# Altium project Logic-Analyzer-01.PrjPcb
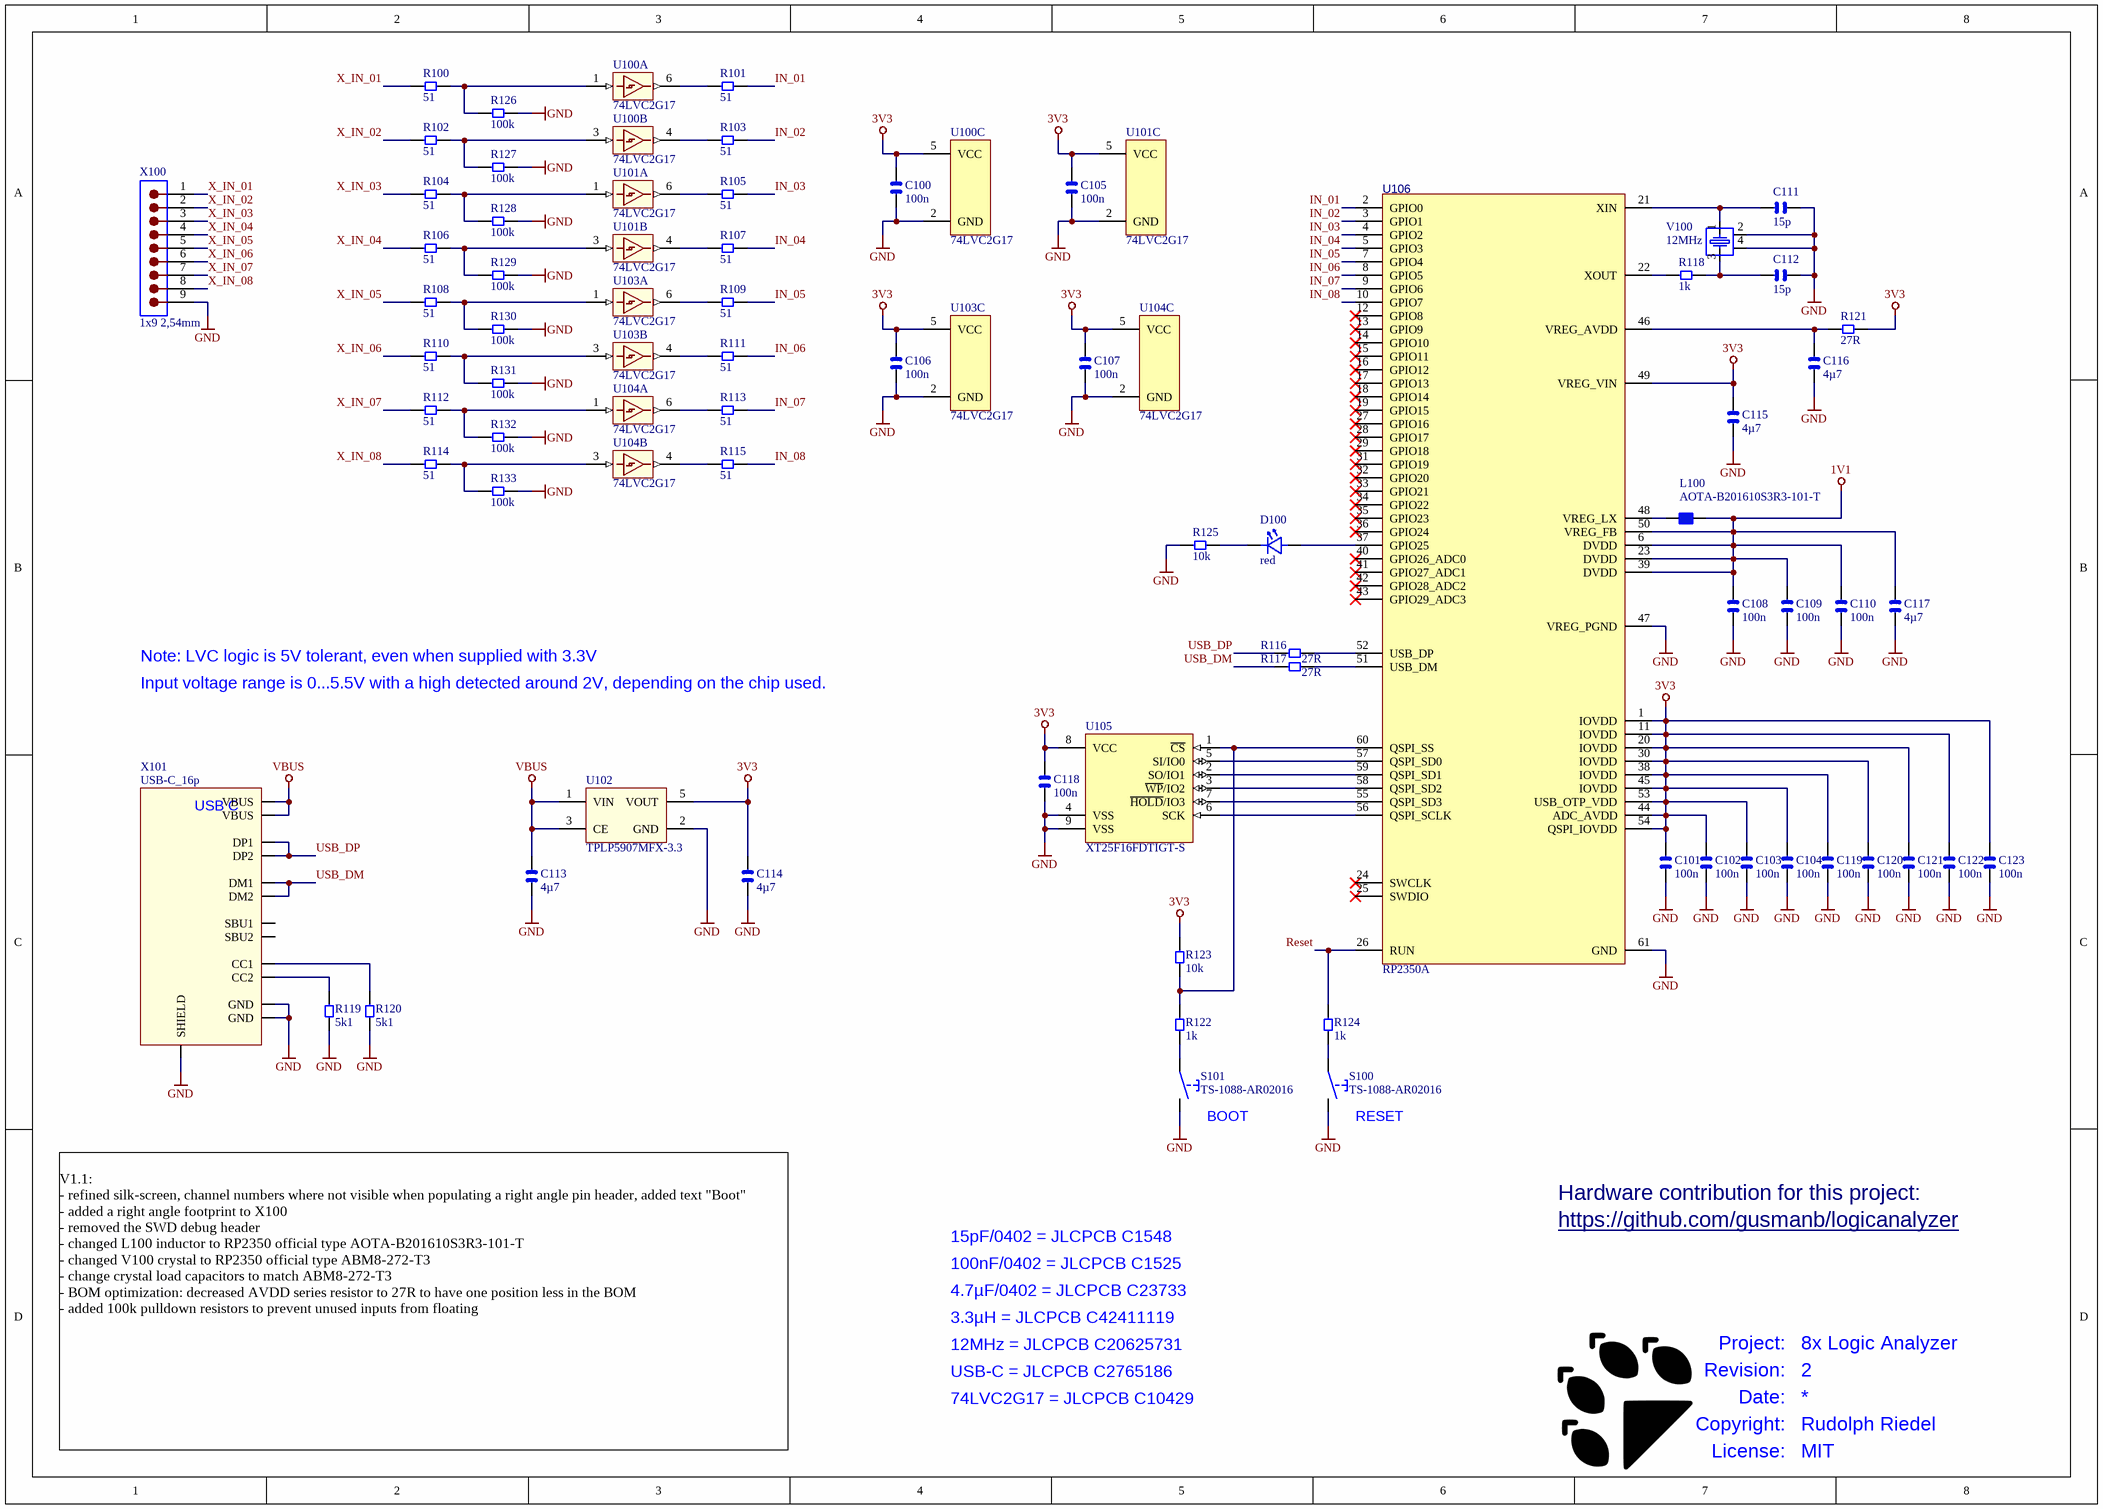
[diagram p0: Logic-Analyzer-01.SchDoc]
1 sheet, 72 parts. Net scope: global (net labels, ports and power ports of the same name join across sheets).
Board file: Logic-Analyzer-01.PcbDoc

## Sheet Logic-Analyzer-01.SchDoc: 8x Logic Analyzer
size A3; Organization: Organization; Address1: Address1; Address2: Address2; Address3: Address3; Address4: Address4; DocumentNumber: 1; Revision: 2; SheetNumber: 1; SheetTotal: 1; PageSetup: Record=PageOptions|CenterHorizontal=True|CenterVertical=True|PrintScale=1.00|XCorrection=1.00|YCorrection=1.00|PrintKind=1|BorderSize=5000000|LeftOffset=0|BottomOffset=0|Orientation=2|PaperLength=1000|PaperWidth=1000|Scale=100|PaperSource=7|PrintQuality=-4|MediaType=1|DitherType=10|PaperKind=A3|PrintScaleMode=0

### Parts
C100  100n  [CAPC1005X06N]
C101  100n  [CAPC1005X06N]
C102  100n  [CAPC1005X06N]
C103  100n  [CAPC1005X06N]
C104  100n  [CAPC1005X06N]
C105  100n  [CAPC1005X06N]
C106  100n  [CAPC1005X06N]
C107  100n  [CAPC1005X06N]
C108  100n  [CAPC1005X06N]
C109  100n  [CAPC1005X06N]
C110  100n  [CAPC1005X06N]
C111  15p  [CAPC1005X06N]
C112  15p  [CAPC1005X06N]
C113  4µ7  [CAPC1005X06N]
C114  4µ7  [CAPC1005X06N]
C115  4µ7  [CAPC1005X06N]
C116  4µ7  [CAPC1005X06N]
C117  4µ7  [CAPC1005X06N]
C118  100n  [CAPC1005X06N]
C119  100n  [CAPC1005X06N]
C120  100n  [CAPC1005X06N]
C121  100n  [CAPC1005X06N]
C122  100n  [CAPC1005X06N]
C123  100n  [CAPC1005X06N]
D100  red  [DIOC1608X06N_LED]
L100  AOTA-B201610S3R3-101-T  [PowerInductor_2.0x1.6]
R100  51  [RESC1608X06L]
R101  51  [RESC1608X06L]
R102  51  [RESC1608X06L]
R103  51  [RESC1608X06L]
R104  51  [RESC1608X06L]
R105  51  [RESC1608X06L]
R106  51  [RESC1608X06L]
R107  51  [RESC1608X06L]
R108  51  [RESC1608X06L]
R109  51  [RESC1608X06L]
R110  51  [RESC1608X06L]
R111  51  [RESC1608X06L]
R112  51  [RESC1608X06L]
R113  51  [RESC1608X06L]
R114  51  [RESC1608X06L]
R115  51  [RESC1608X06L]
R116  27R  [RESC1608X06L]
R117  27R  [RESC1608X06L]
R118  1k  [RESC1608X06L]
R119  5k1  [RESC1608X06L]
R120  5k1  [RESC1608X06L]
R121  27R  [RESC1608X06L]
R122  1k  [RESC1608X06L]
R123  10k  [RESC1608X06L]
R124  1k  [RESC1608X06L]
R125  10k  [RESC1608X06L]
R126  100k  [RESC1005X06N]
R127  100k  [RESC1005X06N]
R128  100k  [RESC1005X06N]
R129  100k  [RESC1005X06N]
R130  100k  [RESC1005X06N]
R131  100k  [RESC1005X06N]
R132  100k  [RESC1005X06N]
R133  100k  [RESC1005X06N]
S100  TS-1088-AR02016  [TS-1088-AR02016]
S101  TS-1088-AR02016  [TS-1088-AR02016]
U100  74LVC2G17  [SOT95P280X110-6N]  (parts A,B,C of 3)
U101  74LVC2G17  [SOT95P280X110-6N]  (parts A,B,C of 3)
U102  TPLP5907MFX-3.3  [SOT95P280X110-5N]
U103  74LVC2G17  [SOT95P280X110-6N]  (parts A,B,C of 3)
U104  74LVC2G17  [SOT95P280X110-6N]  (parts A,B,C of 3)
U105  XT25F16FDTIGT-S  [USONP50X200X300X8N]
U106  RP2350A  [QFN40P700X700X085-60EP]
V100  12MHz  [ABM8]
X100  1x9 2,54mm  [PINH_1x09_2_54mm_RA]
X101  USB-C_16p  [USBC_16P]

### Nets
1V1: C108.2 C109.2 C110.2 C117.2 L100.1 U106.6(DVDD) U106.23(DVDD) U106.39(DVDD) U106.50(VREG_FB)
3V3: C100.2 C101.2 C102.2 C103.2 C104.2 C105.2 C106.2 C107.2 C114.2 C115.2 C118.2 C119.2 C120.2 C121.2 C122.2 C123.2 R121.2 R123.2 U100.5(VCC) U101.5(VCC) U102.5(VOUT) U103.5(VCC) U104.5(VCC) U105.8(VCC) U106.1(IOVDD) U106.11(IOVDD) U106.20(IOVDD) U106.30(IOVDD) U106.38(IOVDD) U106.44(ADC_AVDD) U106.45(IOVDD) U106.49(VREG_VIN) U106.53(USB_OTP_VDD) U106.54(QSPI_IOVDD)
GND: C100.1 C101.1 C102.1 C103.1 C104.1 C105.1 C106.1 C107.1 C108.1 C109.1 C110.1 C111.1 C112.1 C113.1 C114.1 C115.1 C116.1 C117.1 C118.1 C119.1 C120.1 C121.1 C122.1 C123.1 R119.1 R120.1 R125.2 R126.2 R127.2 R128.2 R129.2 R130.2 R131.2 R132.2 R133.2 S100.2 S101.2 U100.2(GND) U101.2(GND) U102.2(GND) U103.2(GND) U104.2(GND) U105.4(VSS) U105.9(VSS) U106.47(VREG_PGND) U106.61(GND) V100.2 V100.4 X100.9 X101.A1-B12(GND) X101.B1-A12(GND) X101.SHIELD
VBUS: C113.2 U102.1(VIN) U102.3(CE) X101.A4-B9(VBUS) X101.B4-A9(VBUS)
IN_01: R101.2 U106.2(GPIO0)
IN_02: R103.2 U106.3(GPIO1)
IN_03: R105.2 U106.4(GPIO2)
IN_04: R107.2 U106.5(GPIO3)
IN_05: R109.2 U106.7(GPIO4)
IN_06: R111.2 U106.8(GPIO5)
IN_07: R113.2 U106.9(GPIO6)
IN_08: R115.2 U106.10(GPIO7)
Reset: R124.2 U106.26(RUN)
USB_DM: R117.1 X101.A7(DM1) X101.B7(DM2)
USB_DP: R116.1 X101.A6(DP1) X101.B6(DP2)
X_IN_01: R100.1 X100.1
X_IN_02: R102.1 X100.2
X_IN_03: R104.1 X100.3
X_IN_04: R106.1 X100.4
X_IN_05: R108.1 X100.5
X_IN_06: R110.1 X100.6
X_IN_07: R112.1 X100.7
X_IN_08: R114.1 X100.8
NetC111_2: C111.2 U106.21(XIN) V100.1
NetC112_2: C112.2 R118.2 V100.3
NetC116_2: C116.2 R121.1 U106.46(VREG_AVDD)
NetD100_1: D100.1 R125.1
NetD100_2: D100.2 U106.37(GPIO25)
NetL100_2: L100.2 U106.48(VREG_LX)
NetR100_2: R100.2 R126.1 U100.1(1A)
NetR101_1: R101.1 U100.6(1Y)
NetR102_2: R102.2 R127.1 U100.3(2A)
NetR103_1: R103.1 U100.4(2Y)
NetR104_2: R104.2 R128.1 U101.1(1A)
NetR105_1: R105.1 U101.6(1Y)
NetR106_2: R106.2 R129.1 U101.3(2A)
NetR107_1: R107.1 U101.4(2Y)
NetR108_2: R108.2 R130.1 U103.1(1A)
NetR109_1: R109.1 U103.6(1Y)
NetR110_2: R110.2 R131.1 U103.3(2A)
NetR111_1: R111.1 U103.4(2Y)
NetR112_2: R112.2 R132.1 U104.1(1A)
NetR113_1: R113.1 U104.6(1Y)
NetR114_2: R114.2 R133.1 U104.3(2A)
NetR115_1: R115.1 U104.4(2Y)
NetR116_2: R116.2 U106.52(USB_DP)
NetR117_2: R117.2 U106.51(USB_DM)
NetR118_1: R118.1 U106.22(XOUT)
NetR119_2: R119.2 X101.B5(CC2)
NetR120_2: R120.2 X101.A5(CC1)
NetR122_1: R122.1 S101.1
NetR122_2: R122.2 R123.1 U105.1(~{CS}) U106.60(QSPI_SS)
NetR124_1: R124.1 S100.1
NetU105_2: U105.2(SO/IO1) U106.59(QSPI_SD1)
NetU105_3: U105.3(~{WP}/IO2) U106.58(QSPI_SD2)
NetU105_5: U105.5(SI/IO0) U106.57(QSPI_SD0)
NetU105_6: U105.6(SCK) U106.56(QSPI_SCLK)
NetU105_7: U105.7(~{HOLD}/IO3) U106.55(QSPI_SD3)

Not connected (* = marked no-connect by the designer): U106 12(GPIO8)* 13(GPIO9)* 14(GPIO10)* 15(GPIO11)* 16(GPIO12)* 17(GPIO13)* 18(GPIO14)* 19(GPIO15)* 24(SWCLK)* 25(SWDIO)* 27(GPIO16)* 28(GPIO17)* 29(GPIO18)* 31(GPIO19)* 32(GPIO20)* 33(GPIO21)* 34(GPIO22)* 35(GPIO23)* 36(GPIO24)* 40(GPIO26_ADC0)* 41(GPIO27_ADC1)* 42(GPIO28_ADC2)* 43(GPIO29_ADC3)*; X101 A8(SBU1) B8(SBU2)

### Notes on the sheet
- Note: LVC logic is 5V tolerant, even when supplied with 3.3V
- Input voltage range is 0...5.5V with a high detected around 2V, depending on the chip used.
- (near S101) BOOT
- (near S100) RESET
- 15pF/0402 = JLCPCB C1548
- https://github.com/gusmanb/logicanalyzer
- Hardware contribution for this project:
- 4.7µF/0402 = JLCPCB C23733
- 100nF/0402 = JLCPCB C1525
- 3.3µH = JLCPCB C42411119
- 12MHz = JLCPCB C20625731
- USB-C = JLCPCB C2765186
- V1.1:
  - refined silk-screen, channel numbers where not visible when populating a right angle pin header, added text "Boot"
  - added a right angle footprint to X100
  - removed the SWD debug header
  - changed L100 inductor to RP2350 official type AOTA-B201610S3R3-101-T
  - changed V100 crystal to RP2350 official type ABM8-272-T3
  - change crystal load capacitors to match ABM8-272-T3
  - BOM optimization: decreased AVDD series resistor to 27R to have one position less in the BOM
  - added 100k pulldown resistors to prevent unused inputs from floating
- 74LVC2G17 = JLCPCB C10429
- Project:
- Revision:
- Date:
- Copyright:
- License:
- Rudolph Riedel
- MIT
- (in symbol USB-C_16p) USB C

### Library data of the parts
C100-C123 = CAPC_0402: 0402 Chip Capacitor; Editor: rriedel; Categorie: generic; Type: unpolarized; Part Number: CAPC_0402; Status: tested; Date: 19.07.2025; PackageDescription: 0402; Group: Capacitor
  C100-C110 C118-C123: Value: 100n
  C111 C112: Value: 15p
  C113-C117: Value: 4µ7
D100 = LED_0603: LED, 0603; Editor: rriedel; Categorie: generic; Group: Diode; Part Number: LED_0603; Value: red; Status: tested; Date: 29.06.2020; PackageDescription: 0603; Type: generic
L100 = AOTA-B201610S3R3-101-T: 3.3µH, 2.8A, 2.0mm x 1.6mm x 1.0mm; Manufacturer: Abracom; Editor: rriedel; Categorie: Part; Group: Inductor; Type: Power; Part Number: AOTA-B201610S3R3-101-T; Value: AOTA-B201610S3R3-101-T; Status: new; Date: 17.08.2025; PackageDescription: 2.0mm x 1.6mm; Part_Number_1: AOTA-B201610S3R3-101-T; Distributor_1: JLCBCP; Distributor_1_Part_Number: C42411119
R100-R125 = RESC_0603: 0603 Chip Resistor; Editor: rriedel; Categorie: generic; Part Number: RESC_0603; Status: tested; PackageDescription: 0603; Group: Resistor; Type: generic
  R100-R115: Value: 51
  R116 R117 R121: Value: 27R
  R118 R122 R124: Value: 1k
  R119 R120: Value: 5k1
  R123 R125: Value: 10k
R126-R133 = RESC_0402: 0402 Chip Resistor; Editor: rriedel; Categorie: generic; Part Number: RESC_0402; Value: 100k; Status: tested; Date: 19.07.2025; Group: Resistor; Type: generic; PackageDescription: 0402
S100 S101 = TS-1088-AR02016: Tact Switch, 4x3x2, 2pin, 12V/50mA; Manufacturer: XunPu; Editor: rriedel; Categorie: Part; Group: Electromechanical; Part Number: TS-1088-AR02016; Value: TS-1088-AR02016; Status: tested; Date: 04.06.2022; PackageDescription: 4mm x 3mm; Part_Number_1: TS-1088-AR02016; Distributor_1: LCSC; Distributor_1_Part_Number: C720477; Type: Switch
U100 U101 U103 U104 = 74LVC2G17: Dual Schmitt-Trigger Buffer with 5.5V tolerant inputs; Manufacturer: TI; Part_Number_1: 74LVC2G17DBVR; Editor: rriedel; Categorie: Part; Group: IC; Part Number: 74LVC2G17; Value: 74LVC2G17; Status: tested; Date: 08.05.2020; PackageDescription: SOT23-6; Distributor_1: Digi-Key; Distributor_1_Part_Number: 296-SN74LVC2G17DBVRCT-ND‎; Type: Logic
U102 = MIC5233-3.3: 100 mA LDO,  Vout= 3,3V, -40°C..125°C; Manufacturer: Microchip; Part_Number_1: MIC5233-3.3YM5; Editor: rriedel; Kategorie: Part; Bauteilart: IC; Unterart: Linear-Regulators; Part Number: MIC5233-3.3; Value: TPLP5907MFX-3.3; Status: tested; Date: 15.09.2016; PackageDescription: SOT23-5; Distributor_1: Farnell; Distributor_1_Part_Number: 2510274
U105 = XT25F16FDTIGT-S: SPI NOR FLASH, 16MBit; Manufacturer: XTX; Editor: rriedel; Categorie: Part; Group: IC; Part Number: XT25F16FDTIGT-S; Value: XT25F16FDTIGT-S; Status: tested; Date: 17.07.2025; Type: Memory; PackageDescription: USON8; Part_Number_1: XT25F16FDTIGT-S; Distributor_1: JLCBCP; Distributor_1_Part_Number: C29781641
U106 = RP2350A: 32-bit Microcontroller, 2x 150MHz Cortex M33; Manufacturer: Raspberry; Editor: rriedel; Categorie: Part; Value: RP2350A; Part Number: RP2350A; Status: tested; Date: 17.07.2025; Group: MicroController; Type: 32bit Raspberry; PackageDescription: QFN60EP; Part_Number_1: RP2350A
V100 = ABM8-272-T3: -40℃~+85℃, 12MHz, Cl=10pF, ±30ppm, SMD3225-4P; Manufacturer: Abracom; Editor: rriedel; Categorie: Part; Group: Crystal; Part Number: ABM8-272-T3; Value: 12MHz; Status: new; Date: 17.08.2025; Type: Misc; PackageDescription: 3.2mm x 2.5mm; Part_Number_1: ABM8-272-T3; Distributor_1: JLCBCP; Distributor_1_Part_Number: C20625731
X100 = PINH_1x9_2_54: Pin-Header 2,54 mm 9pins; Editor: rriedel; Categorie: generic; Group: Connector; Part Number: PINH_1x9_2_54; Value: 1x9 2,54mm; Status: tested; Date: 11.05.2025; Type: Pin-Header
X101 = USB-C_16p: SMD USB-C 16p; Editor: rriedel; Categorie: Part; Group: Connector; Part Number: USB-C_16p; Value: USB-C_16p; Status: tested; Date: 19.07.2025; Type: USB; PackageDescription: USB-C_16p; Distributor_1: JLCBCP; Distributor_1_Part_Number: C2765186